# EAGLE schematic tm5_redraw (EAGLE 8.5.1)
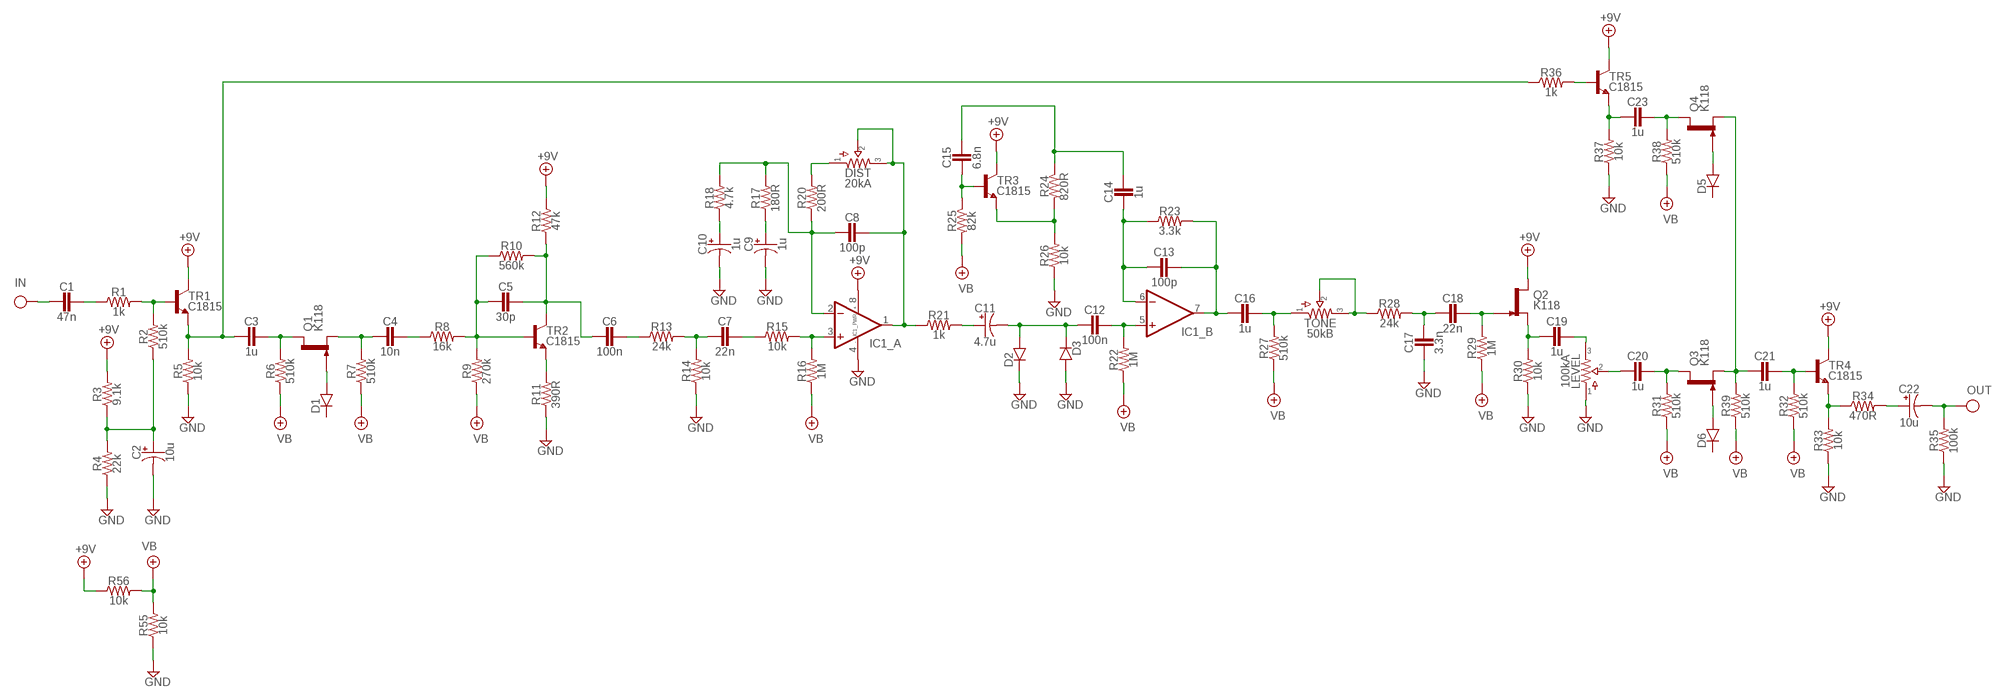
[diagram p0: schematic, sheet 1]

## Parts
C1  47n  CER/FILMBOX.1  [BOX_SMALL]
C2  10u  0500  [050_020]
C3  1u  CER/FILMBOX.1  [BOX_SMALL]
C4  10n  CER/FILMBOX.1  [BOX_SMALL]
C5  30p  CER/FILMBOX.1  [BOX_SMALL]
C6  100n  CER/FILMBOX.1  [BOX_SMALL]
C7  22n  CER/FILMBOX.1  [BOX_SMALL]
C8  100p  CER/FILMBOX.1  [BOX_SMALL]
C9  1u  0500  [050_020]
C10  1u  0500  [050_020]
C11  4.7u  0500  [050_020]
C12  100n  CER/FILMBOX.1  [BOX_SMALL]
C13  100p  CER/FILMBOX.1  [BOX_SMALL]
C14  1u  CER/FILMBOX.1  [BOX_SMALL]
C15  6.8n  CER/FILMBOX.1  [BOX_SMALL]
C16  1u  CER/FILMBOX.1  [BOX_SMALL]
C17  3.3n  CER/FILMBOX.1  [BOX_SMALL]
C18  22n  CER/FILMBOX.1  [BOX_SMALL]
C19  1u  CER/FILMBOX.1  [BOX_SMALL]
C20  1u  CER/FILMBOX.1  [BOX_SMALL]
C21  1u  CER/FILMBOX.1  [BOX_SMALL]
C22  10u  0500  [050_020]
C23  1u  CER/FILMBOX.1  [BOX_SMALL]
D1  DO35.2  [DO35-2]
D2  DO35.2  [DO35-2]
D3  DO35.2  [DO35-2]
D5  DO35.2  [DO35-2]
D6  DO35.2  [DO35-2]
DIST  20kA  POTS16MM  [16MM]
IC1  DUALTH  [DIL0]
LEVEL  100kA  POTS16MM  [16MM]
Q1  K118  2N3819TO-92S  [TO92-]
Q2  K118  2N3819TO-92S  [TO92-]
Q3  K118  2N3819TO-92S  [TO92-]
Q4  K118  2N3819TO-92S  [TO92-]
R1  1k  R_.3B  [R0207/3]
R2  510k  R_.3B  [R0207/3]
R3  9.1k  R_.3B  [R0207/3]
R4  22k  R_.3B  [R0207/3]
R5  10k  R_.3B  [R0207/3]
R6  510k  R_.3B  [R0207/3]
R7  510k  R_.3B  [R0207/3]
R8  16k  R_.3B  [R0207/3]
R9  270k  R_.3B  [R0207/3]
R10  560k  R_.3B  [R0207/3]
R11  390R  R_.3B  [R0207/3]
R12  47k  R_.3B  [R0207/3]
R13  24k  R_.3B  [R0207/3]
R14  10k  R_.3B  [R0207/3]
R15  10k  R_.3B  [R0207/3]
R16  1M  R_.3B  [R0207/3]
R17  180R  R_.3B  [R0207/3]
R18  4.7k  R_.3B  [R0207/3]
R20  200R  R_.3B  [R0207/3]
R21  1k  R_.3B  [R0207/3]
R22  1M  R_.3B  [R0207/3]
R23  3.3k  R_.3B  [R0207/3]
R24  820R  R_.3B  [R0207/3]
R25  82k  R_.3B  [R0207/3]
R26  10k  R_.3B  [R0207/3]
R27  510k  R_.3B  [R0207/3]
R28  24k  R_.3B  [R0207/3]
R29  1M  R_.3B  [R0207/3]
R30  10k  R_.3B  [R0207/3]
R31  510k  R_.3B  [R0207/3]
R32  510k  R_.3B  [R0207/3]
R33  10k  R_.3B  [R0207/3]
R34  470R  R_.3B  [R0207/3]
R35  100k  R_.3B  [R0207/3]
R36  1k  R_.3B  [R0207/3]
R37  10k  R_.3B  [R0207/3]
R38  510k  R_.3B  [R0207/3]
R39  510k  R_.3B  [R0207/3]
R55  10k  R_.3B  [R0207/3]
R56  10k  R_.3B  [R0207/3]
TONE  50kB  POTS16MM  [16MM]
TR1  C1815  2SC828A  [TO92-]
TR2  C1815  2SC828A  [TO92-]
TR3  C1815  2SC828A  [TO92-]
TR4  C1815  2SC828A  [TO92-]
TR5  C1815  2SC828A  [TO92-]

## Nets
+9V: IC1.8(_PWR:V+) Q2.3(D) R3.2 R12.2 R56.1 TR1.2(C) TR3.2(C) TR4.2(C) TR5.2(C)
GND: C2.- C9.- C10.- C17.2 D2.C D3.A IC1.4(_PWR:V-) LEVEL.1 R4.1 R5.1 R11.1 R14.1 R26.1 R30.1 R33.1 R35.1 R37.1 R55.1
IN: C1.2
N$1: C3.1 Q1.3(D) R6.2
N$2: D1.A Q1.2(G)
N$3: C4.2 Q1.1(S) R7.2
N$4: C4.1 R8.1
N$5: C5.2 R8.2 R9.2 R10.1 TR2.1(B)
N$6: R11.2 TR2.3(E)
N$7: C1.1 R1.1
N$8: R1.2 R2.2 TR1.1(B)
N$9: C5.1 C6.2 R10.2 R12.1 TR2.2(C)
N$10: C6.1 R13.1
N$11: C2.+ R2.1 R3.1 R4.2
N$12: C7.2 R13.2 R14.2
N$13: C7.1 R15.1
N$14: IC1.3(_A:+IN) R15.2 R16.2
N$15: C8.2 IC1.2(_A:-IN) R17.2 R18.2 R20.1
N$16: DIST.1 R20.2
N$17: C8.1 DIST.2 DIST.3 IC1.1(_A:OUT) R21.1
N$18: C11.+ R21.2
N$19: C9.+ R17.1
N$20: C10.+ R18.1
N$21: C11.- C12.2 D2.A D3.C
N$22: C12.1 IC1.5(_B:+IN) R22.2
N$23: R24.2 R26.2 TR3.3(E)
N$24: C15.2 R25.1 TR3.1(B)
N$25: C14.1 C15.1 R24.1
N$26: C13.2 C14.2 IC1.6(_B:-IN) R23.1
N$27: C13.1 C16.2 IC1.7(_B:OUT) R23.2
N$28: C16.1 R27.2 TONE.1
N$29: R28.1 TONE.2 TONE.3
N$30: C19.1 LEVEL.3
N$31: C17.1 C18.2 R28.2
N$32: C18.1 Q2.2(G) R29.2
N$33: C19.2 Q2.1(S) R30.2
N$34: R36.2 TR5.1(B)
N$35: C23.2 R37.2 TR5.3(E)
N$36: C23.1 Q4.3(D) R38.2
N$37: D5.A Q4.2(G)
N$38: C21.2 Q3.1(S) Q4.1(S) R39.2
N$39: D6.A Q3.2(G)
N$40: C20.1 Q3.3(D) R31.2
N$41: C20.2 LEVEL.2
N$42: C21.1 R32.2 TR4.1(B)
N$43: R33.2 R34.1 TR4.3(E)
N$44: C22.+ R34.2
N$66: C3.2 R5.2 R36.1 TR1.3(E)
OUT: C22.- R35.2
VB: R6.1 R7.1 R9.1 R16.1 R22.1 R25.2 R27.1 R29.1 R31.1 R32.1 R38.1 R39.1 R55.2 R56.2
Unconnected: D1.C D5.C D6.C

## Library data of the parts
C1 C3-C8 C12-C21 C23 = pedals-capacitors-film:CER/FILM: 47 - 120pF Xicon Ceramic Disc 2.5mm lead spacing
C2 C9-C11 C22 = pedals-capacitors-elec:050
D1-D3 D5 D6 = pedals-diodes:DO35: DO-35 Package Diodes: 1N914
DIST LEVEL TONE = pedals-potentiometers:POTS
IC1 = pedals-integrated circuits:DUAL: OP AMP
Q1-Q4 = pedals-transistors:2N3819: N-CHANNEL FET
R1-R18 R20-R39 R55 R56 = pedals-resistors:R_
TR1-TR5 = pedals-transistors:2SC828A